# EAGLE design Arduino-DIP (EAGLE 6.6.0)
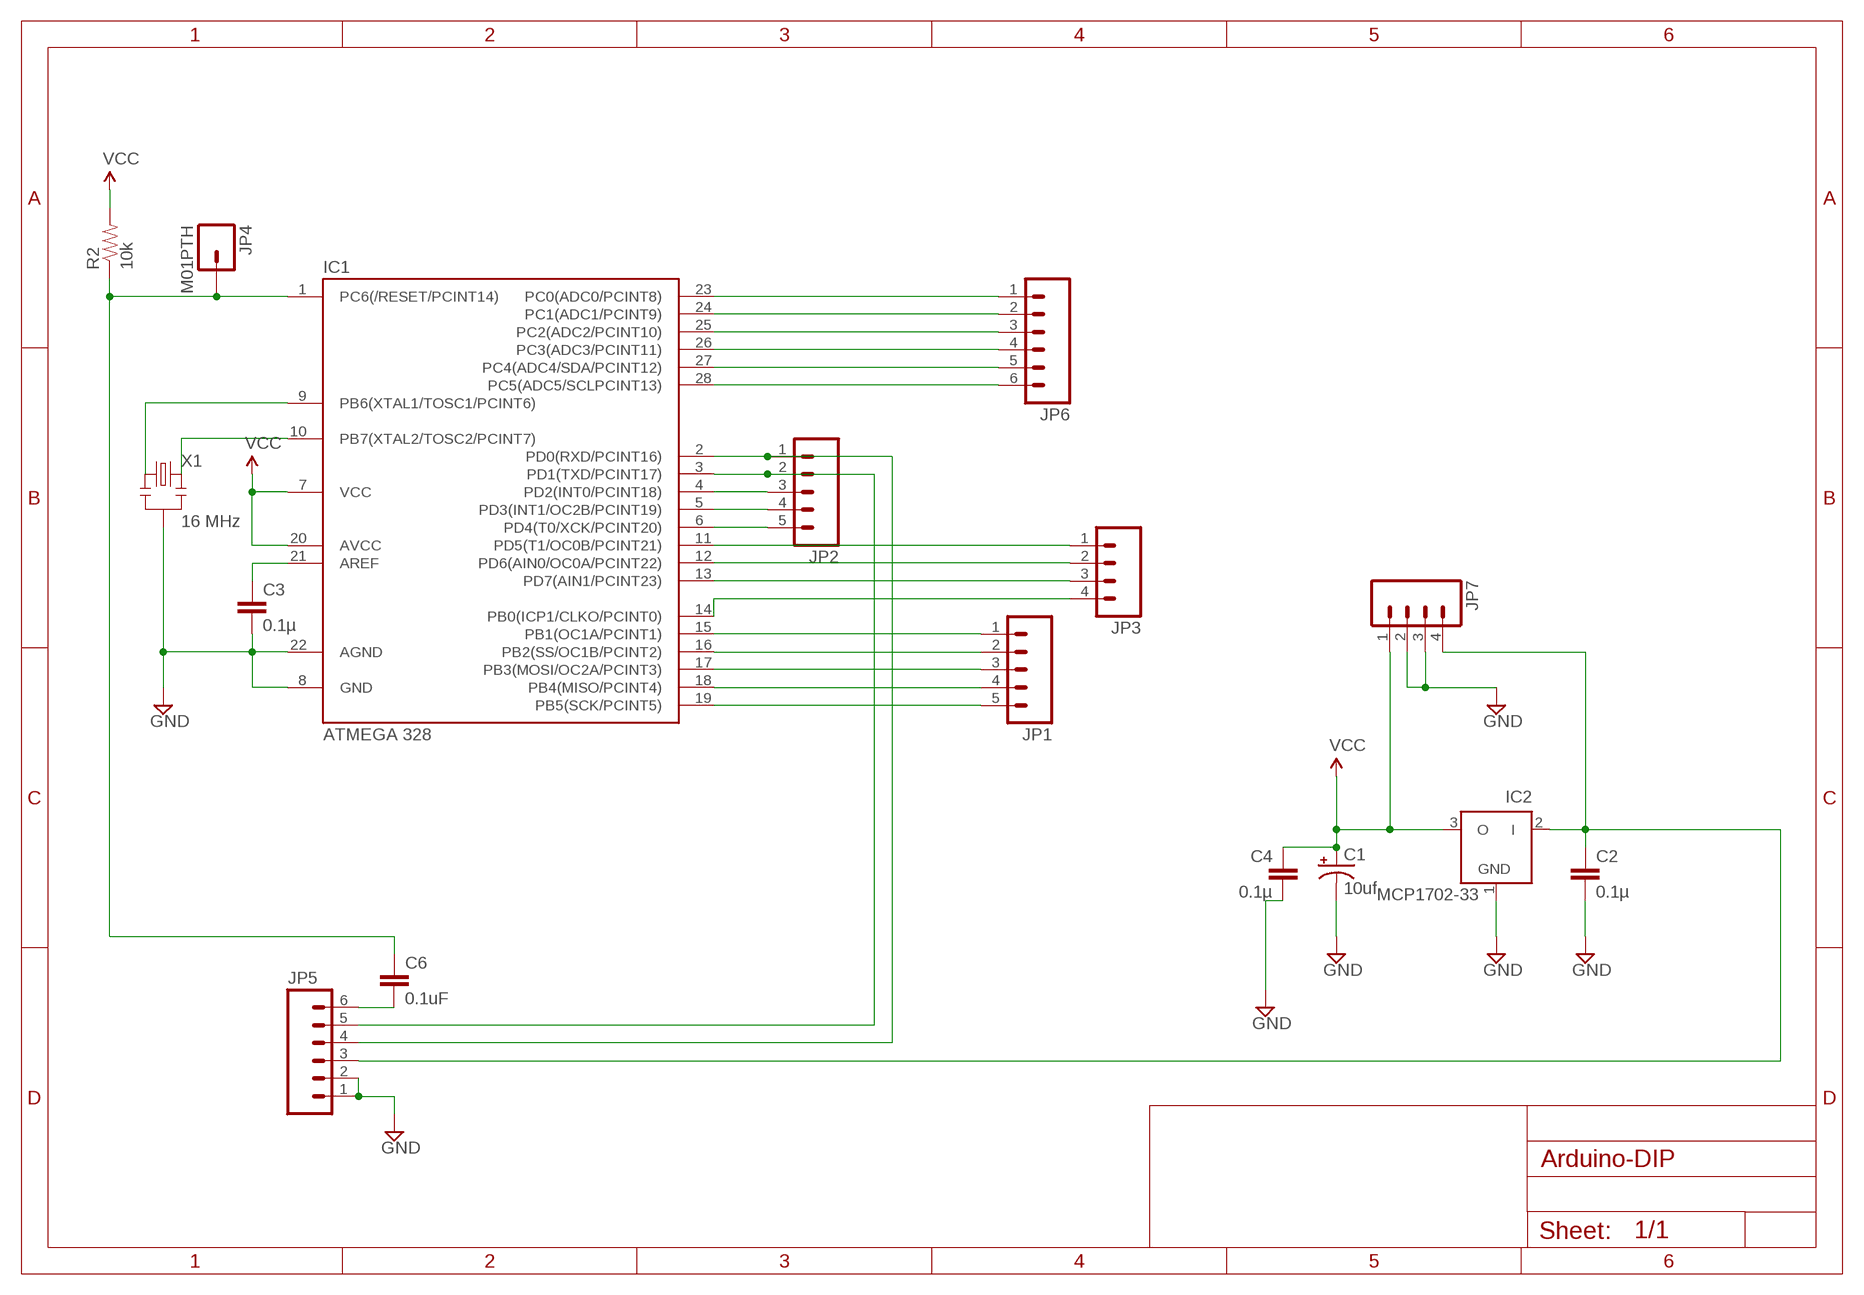
[diagram p0: schematic, sheet 1]

## Parts
C1  10uf  CAP_POLPTH2  [CPOL-RADIAL-10UF-25V]
C2  0.1µ  C-EU025-024X044  [C025-024X044]
C3  0.1µ  C-EU025-024X044  [C025-024X044]
C4  0.1µ  C-EU025-024X044  [C025-024X044]
C6  0.1uF  CAPPTH1  [CAP-PTH-5MM]
IC1  ATMEGA 328  ATMEGA48/88/168-PU  [DIL28-3]
IC2  MCP1702-33  MCP1702Z  [TO92]
JP1  M05PTH  [1X05]
JP2  M05PTH  [1X05]
JP3  M04PTH  [1X04]
JP4  M01PTH  [1X01]
JP5  M06NO_SILK  [1X06_NO_SILK]
JP6  M06NO_SILK  [1X06_NO_SILK]
JP7  M04PTH  [1X04]
R2  10k  RESISTORPTH-1/6W  [1/6W-RES]
X1  16 MHz  RESONATORPTH  [RESONATOR-PTH]

## Nets
GND [power]: C1.2(-) C2.2 C3.2 C4.2 IC1.8(GND) IC1.22(AGND) IC2.1(GND) JP5.1 JP5.2 JP7.2 JP7.3 X1.2
N$1: IC1.9(PB6(XTAL1/TOSC1/PCINT6)) X1.1
N$2: IC1.23(PC0(ADC0/PCINT8)) JP6.1
N$3: IC1.24(PC1(ADC1/PCINT9)) JP6.2
N$4: IC1.25(PC2(ADC2/PCINT10)) JP6.3
N$5: IC1.26(PC3(ADC3/PCINT11)) JP6.4
N$6: IC1.27(PC4(ADC4/SDA/PCINT12)) JP6.5
N$7: IC1.28(PC5(ADC5/SCLPCINT13)) JP6.6
N$8: IC1.4(PD2(INT0/PCINT18)) JP2.3
N$9: IC1.5(PD3(INT1/OC2B/PCINT19)) JP2.4
N$10: IC1.6(PD4(T0/XCK/PCINT20)) JP2.5
N$11: IC1.11(PD5(T1/OC0B/PCINT21)) JP3.1
N$12: IC1.12(PD6(AIN0/OC0A/PCINT22)) JP3.2
N$13: IC1.13(PD7(AIN1/PCINT23)) JP3.3
N$14: IC1.14(PB0(ICP1/CLKO/PCINT0)) JP3.4
N$15: IC1.15(PB1(OC1A/PCINT1)) JP1.1
N$16: IC1.16(PB2(SS/OC1B/PCINT2)) JP1.2
N$17: IC1.17(PB3(MOSI/OC2A/PCINT3)) JP1.3
N$18: IC1.18(PB4(MISO/PCINT4)) JP1.4
N$19: C3.1 IC1.21(AREF)
N$20: C6.2 JP5.6
N$21: IC1.10(PB7(XTAL2/TOSC2/PCINT7)) X1.3
N$22: IC1.19(PB5(SCK/PCINT5)) JP1.5
PWR [power]: C2.1 IC2.2(I) JP5.3 JP7.4
RST: C6.1 IC1.1(PC6(/RESET/PCINT14)) JP4.1 R2.1
RXD: IC1.2(PD0(RXD/PCINT16)) JP2.1 JP5.4
TXD: IC1.3(PD1(TXD/PCINT17)) JP2.2 JP5.5
VCC [power]: C1.1(+) C4.1 IC1.7(VCC) IC1.20(AVCC) IC2.3(O) JP7.1 R2.2

## Library data of the parts
C1 = SparkFun-Capacitors:CAP_POL: Capacitor Polarized These are standard SMD and PTH capacitors. Normally 10uF, 47uF, and 100uF in electrolytic and tantalum varieties. Always verify the external diameter of the through hole cap, it varies with capacity, voltage, and manufacturer. The EIA devices should be standard.
C2-C4 = resistor:C-EU: CAPACITOR, European symbol
C6 = SparkFun-Capacitors:CAP: Capacitor Standard 0603 ceramic capacitor, and 0.1" leaded capacitor.
IC1 = atmega8:ATMEGA48/88/168-PU
IC2 = JeeLabs:MCP1702: 200 mA, Low Power Low Dropout Voltage Regulator
JP1 JP2 = SparkFun-Connectors:M05: Header 5 Standard 5-pin 0.1" header. Use with straight break away headers (SKU : PRT-00116), right angle break away headers (PRT-00553), swiss pins (PRT-00743), machine pins (PRT-00117), and female headers (PRT-00115). Molex polarized connector foot print use with SKU : PRT-08230 with associated crimp pins and housings.
JP3 JP7 = SparkFun-Connectors:M04: Header 4 Standard 4-pin 0.1" header. Use with straight break away headers (SKU : PRT-00116), right angle break away headers (PRT-00553), swiss pins (PRT-00743), machine pins (PRT-00117), and female headers (PRT-00115). Molex polarized connector foot print use with SKU : PRT-08231 with associated crimp pins and housings. 1MM SMD Version SKU: PRT-10208
JP4 = SparkFun-Connectors:M01: Header 1 Standard 1-pin 0.1" header. Use with straight break away headers (SKU : PRT-00116), right angle break away headers (PRT-00553), swiss pins (PRT-00743), machine pins (PRT-00117), and female headers (PRT-00115).
JP5 JP6 = SparkFun-Connectors:M06: Header 6 Standard 6-pin 0.1" header. Use with straight break away headers (SKU : PRT-00116), right angle break away headers (PRT-00553), swiss pins (PRT-00743), machine pins (PRT-00117), and female headers (PRT-00115). Molex polarized connector foot print use with SKU : PRT-08094 with associated crimp pins and housings. NOTES ON THE VARIANTS LOCK and LOCK_LONGPADS... This footprint was designed to help hold the alignment of a through-hole component (i.e. 6-pin header) while soldering it into place. You may notice that each hole has been shifted either up or down by 0.005 of an inch from it's more standard position (which is a perfectly straight line). This slight alteration caused the pins (the squares in the middle) to touch the edges of the holes. Because they are alternating, it causes a "brace" to hold the component in place. 0.005 has proven to be the perfect amount of "off-center" position when using our standard breakaway headers. Although looks a little odd when you look at the bare footprint, once you have a header in there, the alteration is very hard to notice. Also,if you push a header all the way into place, it is covered up entirely on the bottom side. This idea of altering the position of holes to aid alignment will be further integrated into the Sparkfun Library for other footprints. It can help hold any component with 3 or more connection pins.
R2 = SparkFun-Passives:RESISTOR: Resistor Basic schematic elements and footprints for 0603, 1206, and PTH resistors.
X1 = SparkFun:RESONATOR: Resonator Small SMD resonator. This is the itty bitty 10/20MHz resonators with built in caps. CSTCE10M0G55 and CSTCE20M0V53. Footprint has been reviewed closely but hasn't been tested yet.

## Net classes
1 power: width 0.406 mm

## Board
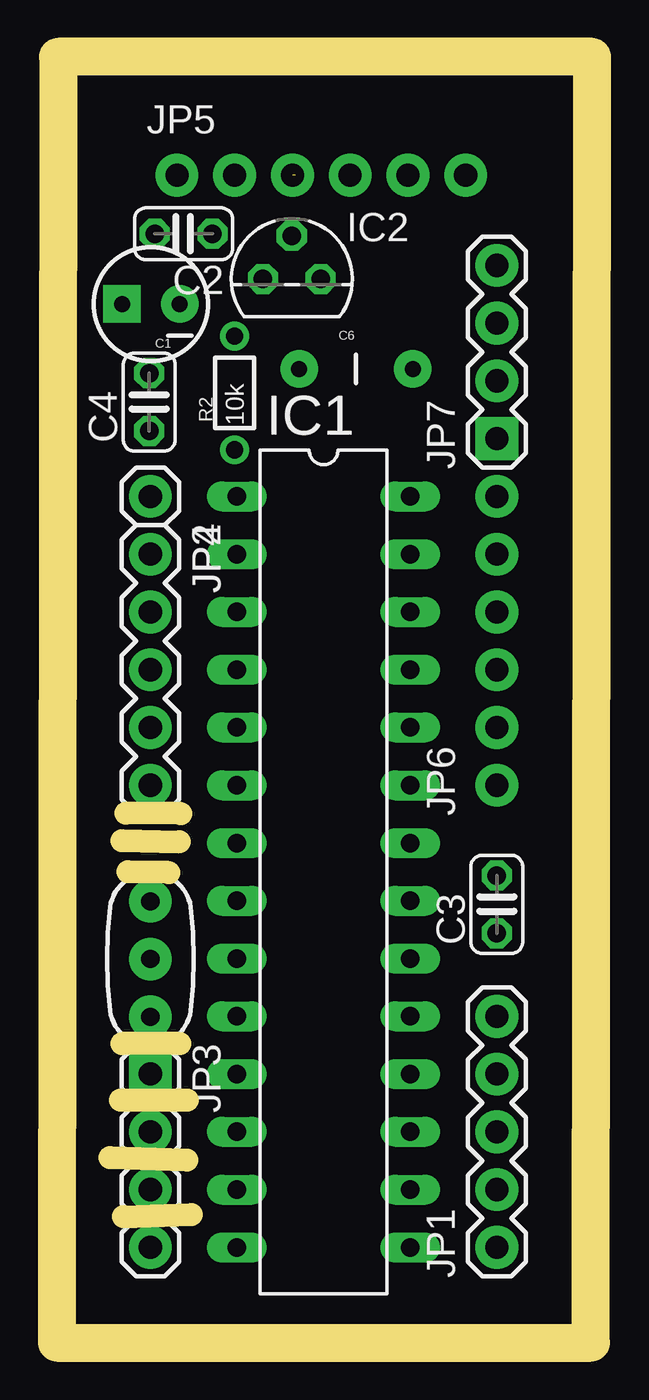
[diagram p1: board, top side]
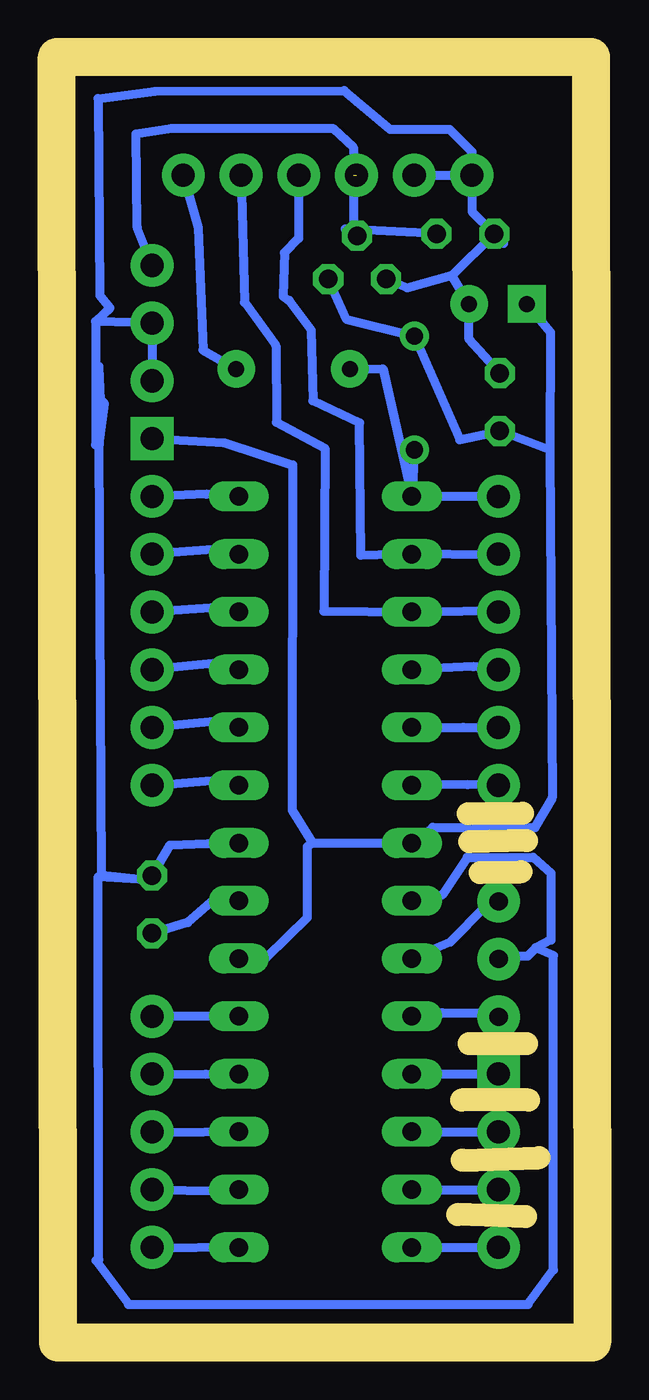
[diagram p2: board, bottom side, seen from below]

Size 23.55 x 56.54 mm. Coordinates in mm from the lower left corner, seen from the top.
Outline: 0,0 23.5,0 23.55,56.54 0.05,56.54 0,0
Copper layers (1*16): Top 0.035mm / dielectric 1.5mm / Bottom 0.035mm
Design rules "default": minimum track width 10mil, minimum drill 24mil, track to track 8mil, track to pad 8mil, pad to pad 8mil, via to via 8mil, smd to smd 8mil, copper to edge 40mil, drill to drill 8mil, minimum pad ring 10mil, minimum via ring 8mil, stop-mask expansion 4mil, vias tented up to drill 0mil, thermal gap 10mil
Milling: 7 lines

### Footprints (pad centres in the part's own frame; a part is rotated, then mirrored left to right if it is on the bottom)
CPOL-RADIAL-10UF-25V = drill 0.7 pad 1.651 square: 1 1.27,0 | drill 0.7 pad 1.651: 2 -1.27,0
C025-024X044 = drill 0.813 octagon: 1 -1.27,0; 2 1.27,0
CAP-PTH-5MM = drill 0.7 pad 1.651: 1 -2.5,0; 2 2.5,0
DIL28-3 = drill 0.813 long: 1 -16.51,-3.81; 2 -13.97,-3.81; 3 -11.43,-3.81; 4 -8.89,-3.81; 5 -6.35,-3.81; 6 -3.81,-3.81; 7 -1.27,-3.81; 8 1.27,-3.81; 9 3.81,-3.81; 10 6.35,-3.81; 11 8.89,-3.81; 12 11.43,-3.81; 13 13.97,-3.81; 14 16.51,-3.81; 15 16.51,3.81; 16 13.97,3.81; 17 11.43,3.81; 18 8.89,3.81; 19 6.35,3.81; 20 3.81,3.81; 21 1.27,3.81; 22 -1.27,3.81; 23 -3.81,3.81; 24 -6.35,3.81; 25 -8.89,3.81; 26 -11.43,3.81; 27 -13.97,3.81; 28 -16.51,3.81
TO92 = drill 0.813 octagon: 1 -1.27,0; 2 0,1.905; 3 1.27,0
1X05 = drill 1.016 pad 1.88: 1 0,0; 2 2.54,0; 3 5.08,0; 4 7.62,0; 5 10.16,0
1X04 = drill 1.016 pad 1.88 square: 1 0,0 | drill 1.016 pad 1.88: 2 2.54,0; 3 5.08,0; 4 7.62,0
1X01 = drill 1.016 pad 1.88: 1 0,0
1X06_NO_SILK = drill 1.016 pad 1.88: 1 0,0; 2 2.54,0; 3 5.08,0; 4 7.62,0; 5 10.16,0; 6 12.7,0
1/6W-RES = drill 0.762: 1 -2.5,0; 2 2.5,0
RESONATOR-PTH = drill 0.8 pad 1.88: 1 -2.54,0; 2 0,0; 3 2.54,0

### Placement (x,y rotation side)
C1  4.14,45.67 180 top
C2  5.58,48.76 180 top
C3  19.35,19.27 90 top
C4  4.06,41.36 90 top
C6  13.16,42.82 0 top
IC1  11.73,20.7 270 top
IC2  10.34,46.77 0 top
JP1  19.35,4.19 90 top
JP2  4.11,34.67 270 top
JP3  4.11,11.81 270 top
JP4  4.11,37.21 270 top
JP5  5.28,51.33 0 top
JP6  19.35,24.51 90 top
JP7  19.35,39.75 90 top
R2  7.82,41.76 90 top
X1  4.11,16.87 270 top

### Tracks (layer width: path | path; a pad name or v marks a point on that pad's centre or on a via)
GND
  Bottom 0.406: IC1.22 16.32,21.87 16.91,21.94 18.56,21.88 C3.2 19.44,20.47 19.95,20.4 | 19.95,20.4 21.57,20.56 21.68,39.5 | 19.95,20.4 21.73,20.49 21.7,3.66 21.83,3.62 20.4,1.68 2.82,1.68 1.7,3.2 1.7,17.02 2.48,17.36 | 21.68,39.5 21.45,41.29 21.61,41.48 21.69,42.93 | 21.84,44.91 21.21,45.49 21.66,46.06 21.73,54.7 19.23,55.03 10.9,55.05 8.88,53.35 6.27,53.35 5.28,52.37 JP5.1 | 21.84,44.91 21.84,39.49 21.68,39.5 | 2.48,17.36 1.8,17.7 1.8,20.65 2.59,21.34 5.49,21.34 6.59,19.7 7.56,19.54 7.67,19.43 IC1.8 | 2.48,17.36 2.85,16.99 3.92,16.99 X1.2 | IC2.1 8.13,46.38 6.17,46.91 | JP7.2 JP7.3 21.84,44.91 | JP5.2 JP5.1 | JP5.1 5.28,49.74 C2.2 | 3.89,48.35 C2.2 | C2.2 6.17,46.91 | 6.17,46.91 C1.2 5.41,44.12 C4.2
N$1
  Bottom 0.406: 7.37,17.35 IC1.9 6.25,17.6 4.67,19.2 4.05,19.66 X1.1
N$2
  Bottom 0.406: JP6.1 16.2,24.76 16,24.46 IC1.23
N$3
  Bottom 0.406: IC1.24 16.36,27.35 JP6.2
N$4
  Bottom 0.406: IC1.25 16.46,29.89 JP6.3
N$5
  Bottom 0.406: IC1.26 16.46,32.33 JP6.4
N$6
  Bottom 0.406: IC1.27 16.66,34.87 JP6.5
N$7
  Bottom 0.406: IC1.28 16.96,37.31 JP6.6
N$8
  Bottom 0.406: JP2.3 5.23,29.73 IC1.4
N$9
  Bottom 0.406: IC1.5 5.66,27.06 JP2.4
N$10
  Bottom 0.406: JP2.5 5.48,24.54 IC1.6
N$11
  Bottom 0.406: IC1.11 JP3.1
N$12
  Bottom 0.406: IC1.12 JP3.2
N$13
  Bottom 0.406: IC1.13 JP3.3
N$14
  Bottom 0.406: IC1.14 JP3.4
N$15
  Bottom 0.406: IC1.15 19.17,4.16 JP1.1
N$16
  Bottom 0.406: JP1.2 16.37,6.68 IC1.16
N$17
  Bottom 0.406: IC1.17 18.59,9.24 JP1.3
N$18
  Bottom 0.406: JP1.4 16.99,11.81 IC1.18
N$19
  Bottom 0.406: IC1.21 16.04,19.33 16.77,19.36 17.79,18.48 C3.1
N$20
  Bottom 0.406: C6.2 17.12,43.65 17.32,49.03 JP5.6
N$21
  Bottom 0.406: IC1.10 6.83,14.35 6.6,14.5 4.3,14.5 X1.3
N$22
  Bottom 0.406: IC1.19 18.84,14.34 JP1.5
PWR  (1 unrouted)
  Bottom 0.406: C2.1 10.86,48.97 IC2.2 10.51,48.84 10.51,51.34 10.5,52.56 11.4,53.4 18.5,53.4 20.06,53.16 20.01,49.04 JP7.4
RST
  Bottom 0.406: JP4.1 IC1.1 | C6.1 9.21,42.82 IC1.1 | R2.1 IC1.1
RXD
  Bottom 0.406: JP2.1 4.47,34.63 IC1.2 10.18,34.62 10.22,40.45 12.28,41.42 12.36,44.52 13.33,45.83 13.59,46.02 13.54,47.93 12.9,48.56 JP5.4
TXD
  Bottom 0.406: IC1.3 4.56,32.19 JP2.2 | 7.59,31.86 IC1.3 | IC1.3 11.8,32.16 11.75,39.33 13.89,40.47 13.91,43.83 15.29,45.74 JP5.5
VCC
  Bottom 0.406: IC1.20 14.32,16.93 12.52,18.69 12.52,21.82 12.3,21.97 | 12.3,21.97 10.21,21.96 IC1.7 7,22.66 2.51,22.65 1.75,23.96 1.85,39.14 | 1.85,39.14 1.85,39.25 C4.1 5.82,39.7 R2.2 10.82,45.01 IC2.3 | 12.3,21.97 13.2,23.41 13.17,38.59 16.19,39.58 JP7.1 | C1.1 1.83,44.42 1.85,39.14

### Text on the board
Document: RESET / D0 / D1 / D2 / D3 / D4 | Vin / GND / GND / Vcc / A5 / A4 / A3 / A2 / A1 / A0 | D5 / D6 / D7 / D8 | D13 / D12 / D11 / D10 / D9